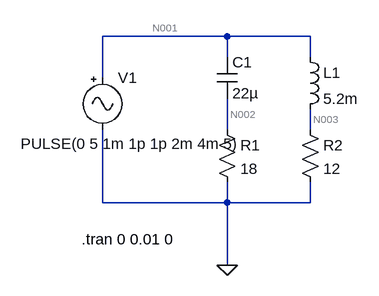
[diagram p0: schematic tp_final_sim.asc]
tp_final_sim.asc, the LTspice schematic file:
Version 4
SHEET 1 880 680
WIRE 96 64 -96 64
WIRE 224 64 96 64
WIRE 96 96 96 64
WIRE 224 96 224 64
WIRE -96 128 -96 64
WIRE 96 208 96 160
WIRE 224 208 224 176
WIRE -96 320 -96 208
WIRE 96 320 96 288
WIRE 96 320 -96 320
WIRE 224 320 224 288
WIRE 224 320 96 320
WIRE 96 416 96 320
FLAG 96 416 0
SYMBOL ind 208 80 R0
SYMATTR InstName L1
SYMATTR Value 5.2m
SYMBOL cap 80 96 R0
SYMATTR InstName C1
SYMATTR Value 22µ
SYMBOL res 80 192 R0
SYMATTR InstName R1
SYMATTR Value 18
SYMBOL res 208 192 R0
SYMATTR InstName R2
SYMATTR Value 12
SYMBOL Misc\\signal -96 112 R0
WINDOW 3 -126 117 Left 2
WINDOW 123 0 0 Left 2
WINDOW 39 0 0 Left 2
SYMATTR Value PULSE(0 5 1m 1p 1p 2m 4m 5)
SYMATTR InstName V1
TEXT -128 376 Left 2 !.tran 0 0.01 0

The netlist it stands for:
* tp_final_sim.asc
L1 N001 N003 5.2m
C1 N001 N002 22µ
R1 N002 0 18
R2 N003 0 12
V1 N001 0 PULSE(0 5 1m 1p 1p 2m 4m 5)
.tran 0 0.01 0
.backanno
.end

* Results of the author's LTspice run, read from the files saved beside the schematic
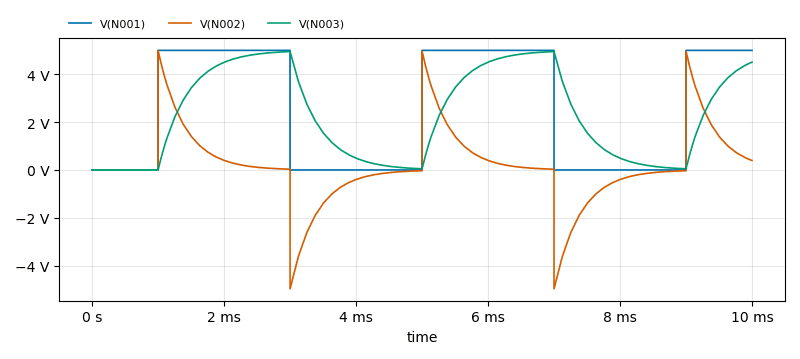
[diagram p1: Transient Analysis of tp_final_sim.asc, plotted from the saved traces]
* Transient Analysis, 1 run:
*   V(N001): min 0 V, max 5 V, average 2.5 V, rms 3.536 V, last 5 V
*   V(N002): min -4.968 V, max 5 V, average 182.4 mV, rms 1.583 V, last 397.6 mV
*   V(N003): min 0 V, max 4.951 V, average 2.304 V, rms 2.997 V, last 4.507 V